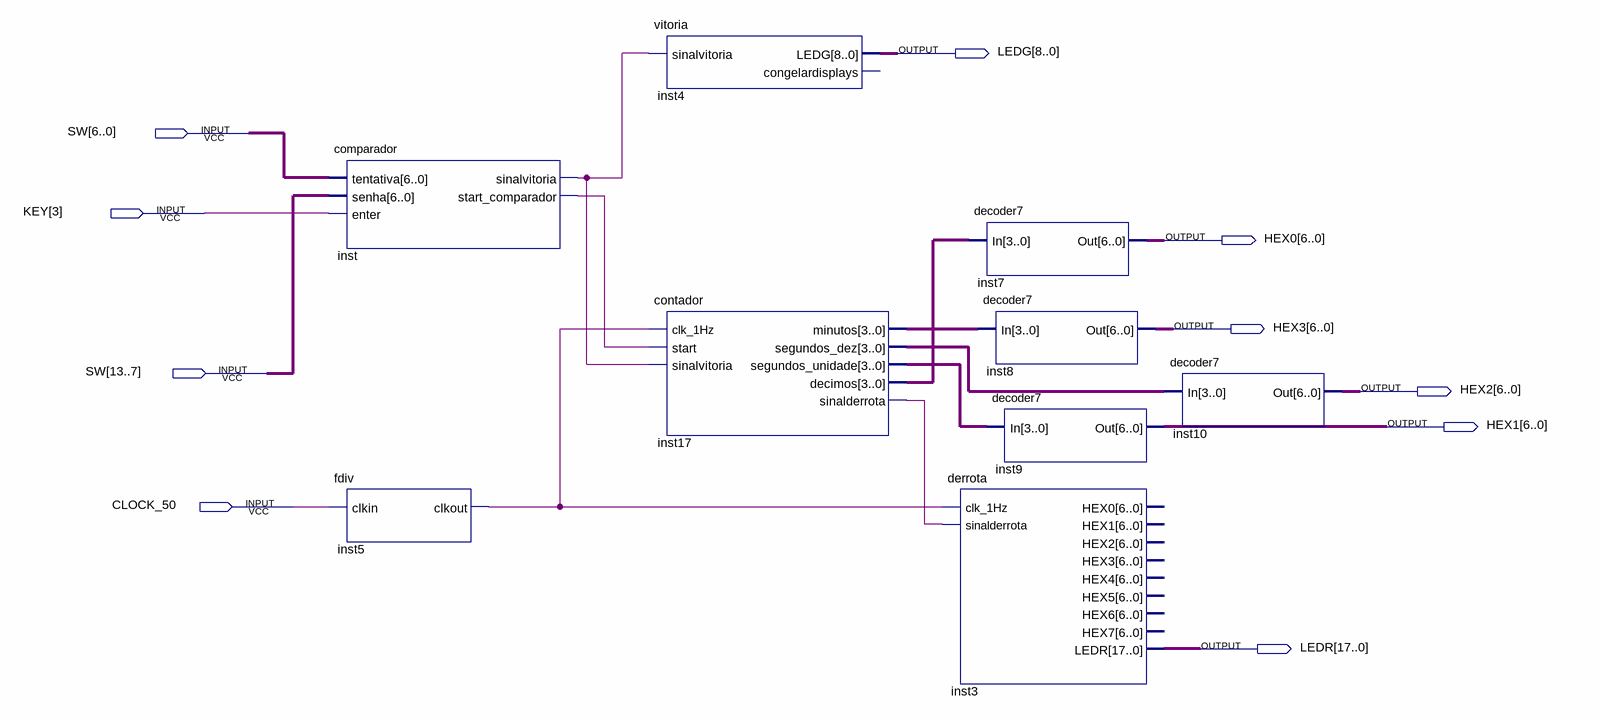
[diagram p0: schematic sheet]
// Quartus schematic esquematicoprincipal.bdf as structural Verilog: 9 symbols, 10 pins
module esquematicoprincipal (
  input  [13:0] SW,
  input  [3:3] KEY,
  input  CLOCK_50,
  output [8:0] LEDG,
  output [6:0] HEX0,
  output [6:0] HEX3,
  output [6:0] HEX2,
  output [6:0] HEX1,
  output [17:0] LEDR
);

  wire inst5_clkout, inst17_sinalderrota, inst_sinalvitoria, inst_start_comparador;
  wire [3:0] inst17_decimos, inst17_minutos, inst17_segundos_dez, inst17_segundos_unidade;

  comparador inst (
    .tentativa(SW[6:0]), .senha(SW[13:7]), .enter(KEY[3]), .sinalvitoria(inst_sinalvitoria),
    .start_comparador(inst_start_comparador));
  fdiv inst5 (.clkin(CLOCK_50), .clkout(inst5_clkout));
  vitoria inst4 (.sinalvitoria(inst_sinalvitoria), .LEDG(LEDG));  // open: congelardisplays
  contador inst17 (
    .clk_1Hz(inst5_clkout), .start(inst_start_comparador), .sinalvitoria(inst_sinalvitoria),
    .minutos(inst17_minutos), .segundos_dez(inst17_segundos_dez), .segundos_unidade(inst17_segundos_unidade),
    .decimos(inst17_decimos), .sinalderrota(inst17_sinalderrota));
  decoder7 inst7 (.In(inst17_decimos), .Out(HEX0));
  decoder7 inst8 (.In(inst17_minutos), .Out(HEX3));
  derrota inst3 (
    .clk_1Hz(inst5_clkout), .sinalderrota(inst17_sinalderrota), .LEDR(LEDR));  // open: HEX0, HEX1, HEX2, HEX3, HEX4, HEX5, HEX6, HEX7
  decoder7 inst9 (.In(inst17_segundos_unidade), .Out(HEX1));
  decoder7 inst10 (.In(inst17_segundos_dez), .Out(HEX2));
endmodule
